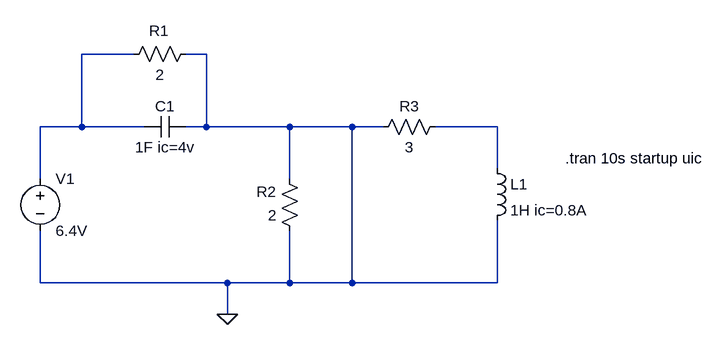
[diagram p0: schematic auf802.asc]
auf802.asc, the LTspice schematic file:
Version 4
SHEET 1 1004 680
WIRE 80 176 0 176
WIRE 192 176 160 176
WIRE 0 288 0 176
WIRE 0 288 -64 288
WIRE 96 288 0 288
WIRE 192 288 192 176
WIRE 192 288 160 288
WIRE 320 288 192 288
WIRE 416 288 320 288
WIRE 464 288 416 288
WIRE 640 288 544 288
WIRE 640 352 640 288
WIRE -64 368 -64 288
WIRE 320 368 320 288
WIRE -64 528 -64 448
WIRE 224 528 -64 528
WIRE 320 528 320 448
WIRE 320 528 224 528
WIRE 416 528 416 288
WIRE 416 528 320 528
WIRE 640 528 640 432
WIRE 640 528 416 528
WIRE 224 576 224 528
FLAG 224 576 0
SYMBOL voltage -64 352 R0
SYMATTR InstName V1
SYMATTR Value 6.4V
SYMBOL Res 176 160 R90
WINDOW 0 -4 57 VBottom 2
WINDOW 3 32 56 VTop 2
SYMATTR InstName R1
SYMATTR Value 2
SYMBOL Res 336 464 R180
WINDOW 0 36 76 Left 2
WINDOW 3 36 40 Left 2
SYMATTR InstName R2
SYMATTR Value 2
SYMBOL Res 448 304 R270
WINDOW 0 32 56 VTop 2
WINDOW 3 0 56 VBottom 2
SYMATTR InstName R3
SYMATTR Value 3
SYMBOL Cap 160 272 R90
WINDOW 0 0 32 VBottom 2
WINDOW 3 32 32 VTop 2
SYMATTR InstName C1
SYMATTR Value 1F ic=4v
SYMBOL ind 624 336 R0
SYMATTR InstName L1
SYMATTR Value 1H ic=0.8A
TEXT 744 336 Left 2 !.tran 10s startup uic

The netlist it stands for:
* auf802.asc
V1 N001 0 6.4V
R1 0 N001 2
R2 0 0 2
R3 0 N002 3
C1 0 N001 1F ic=4v
L1 N002 0 1H ic=0.8A
.tran 10s startup uic
.backanno
.end